# EAGLE design 8085_try2 (EAGLE 9.2.0)
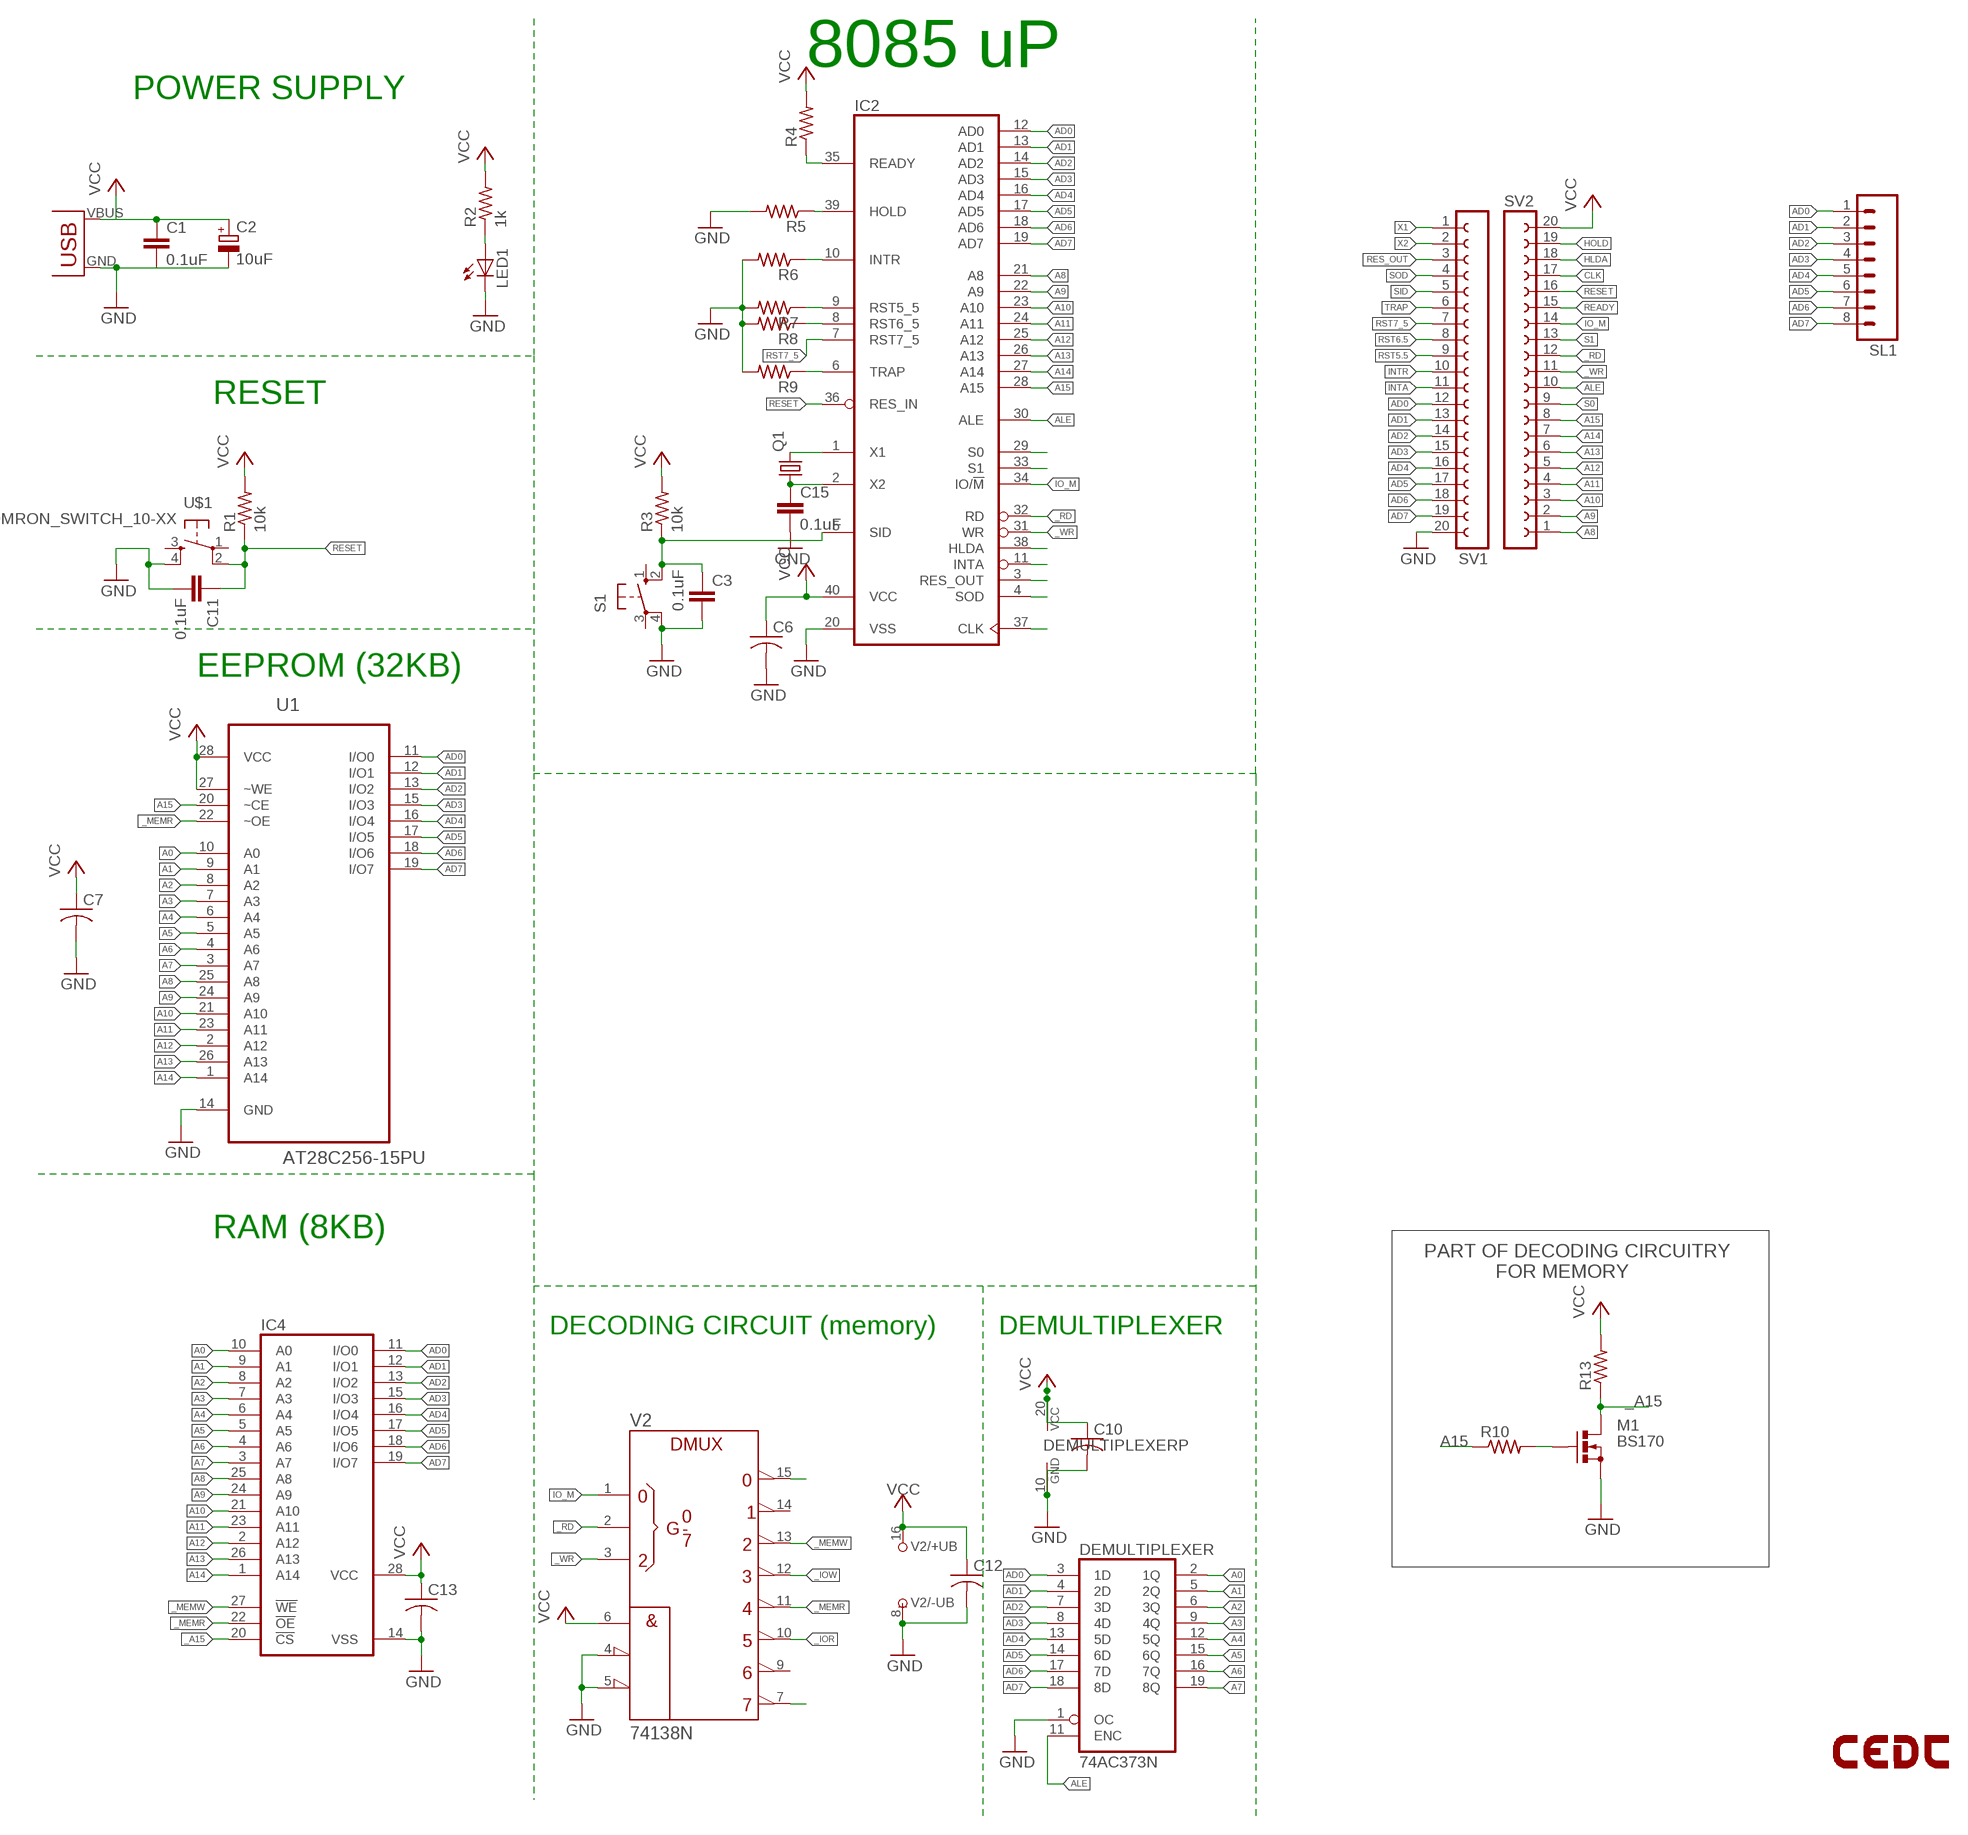
[diagram p0: schematic, sheet 1]

## Parts
C1  0.1uF  C2,5-3  [C2.5-3]
C2  10uF  CPOL-EUE2.5-6  [E2,5-6]
C3  0.1uF  C2,5-3  [C2.5-3]
C6  CAP0805  [C0805]
C7  CAP0805  [C0805]
C10  CAP0805  [C0805]
C11  0.1uF  C2,5-3  [C2.5-3]
C12  CAP0805  [C0805]
C13  CAP0805  [C0805]
C15  0.1uF  C2,5-3  [C2.5-3]
DEMULTIPLEXER  74AC373N  [DIL20]
IC2  8085  [DIL40]
IC4  62256P  [DIL28-6]
LED1  LED3MM  [LED3MM]
LOGO1  LOGO-CEDTBOT-18MM  [LOGO-CEDT-BOT-18MM]
M1  BS170  [SOT54E]
Q1  CRYSTALHC49US  [HC49US]
R1  10k  RESISTOR0207/7  [0207/7]
R2  1k  RESISTOR0207/7  [0207/7]
R3  10k  RESISTOR0207/7  [0207/7]
R4  RESISTOR0805  [R0805]
R5  RESISTOR0805  [R0805]
R6  RESISTOR0805  [R0805]
R7  RESISTOR0805  [R0805]
R8  RESISTOR0805  [R0805]
R9  RESISTOR0805  [R0805]
R10  R-US_0204/5  [0204/5]
R13  R-US_0204/5  [0204/5]
S1  40-XX  [B3F-40XX]
SL1  M08  [08P]
SV1  FE20-1  [FE20]
SV2  FE20-1  [FE20]
U1  AT28C256-15PU  [DIP254P1524X482-28]
U$1  OMRON_SWITCH_10-XX  [B3F-10XX]
U$2  USB(POWER)  [USB(POWER)]
V2  74138N  [DIL16]

## Nets
_A15: IC4.20(!CS) M1.D R13.1
_IOR: V2.10(Y5)
_IOW: V2.12(Y3)
_MEMR: IC4.22(!OE) U1.22(~OE) V2.11(Y4)
_MEMW: IC4.27(!WE) V2.13(Y2)
_RD: IC2.32(RD) SV2.12 V2.2(B)
_WR: IC2.31(WR) SV2.11 V2.3(C)
A0: DEMULTIPLEXER.2(1Q) IC4.10(A0) U1.10(A0)
A1: DEMULTIPLEXER.5(2Q) IC4.9(A1) U1.9(A1)
A2: DEMULTIPLEXER.6(3Q) IC4.8(A2) U1.8(A2)
A3: DEMULTIPLEXER.9(4Q) IC4.7(A3) U1.7(A3)
A4: DEMULTIPLEXER.12(5Q) IC4.6(A4) U1.6(A4)
A5: DEMULTIPLEXER.15(6Q) IC4.5(A5) U1.5(A5)
A6: DEMULTIPLEXER.16(7Q) IC4.4(A6) U1.4(A6)
A7: DEMULTIPLEXER.19(8Q) IC4.3(A7) U1.3(A7)
A8: IC2.21(A8) IC4.25(A8) SV2.1 U1.25(A8)
A9: IC2.22(A9) IC4.24(A9) SV2.2 U1.24(A9)
A10: IC2.23(A10) IC4.21(A10) SV2.3 U1.21(A10)
A11: IC2.24(A11) IC4.23(A11) SV2.4 U1.23(A11)
A12: IC2.25(A12) IC4.2(A12) SV2.5 U1.2(A12)
A13: IC2.26(A13) IC4.26(A13) SV2.6 U1.26(A13)
A14: IC2.27(A14) IC4.1(A14) SV2.7 U1.1(A14)
A15: IC2.28(A15) R10.1 SV2.8 U1.20(~CE)
AD0: DEMULTIPLEXER.3(1D) IC2.12(AD0) IC4.11(I/O0) SL1.1 SV1.12 U1.11(I/O0)
AD1: DEMULTIPLEXER.4(2D) IC2.13(AD1) IC4.12(I/O1) SL1.2 SV1.13 U1.12(I/O1)
AD2: DEMULTIPLEXER.7(3D) IC2.14(AD2) IC4.13(I/O2) SL1.3 SV1.14 U1.13(I/O2)
AD3: DEMULTIPLEXER.8(4D) IC2.15(AD3) IC4.15(I/O3) SL1.4 SV1.15 U1.15(I/O3)
AD4: DEMULTIPLEXER.13(5D) IC2.16(AD4) IC4.16(I/O4) SL1.5 SV1.16 U1.16(I/O4)
AD5: DEMULTIPLEXER.14(6D) IC2.17(AD5) IC4.17(I/O5) SL1.6 SV1.17 U1.17(I/O5)
AD6: DEMULTIPLEXER.17(7D) IC2.18(AD6) IC4.18(I/O6) SL1.7 SV1.18 U1.18(I/O6)
AD7: DEMULTIPLEXER.18(8D) IC2.19(AD7) IC4.19(I/O7) SL1.8 SV1.19 U1.19(I/O7)
ALE: DEMULTIPLEXER.11(ENC) IC2.30(ALE) SV2.10
CLK: IC2.37(CLK) SV2.17
GND: C1.2 C2.- C3.2 C6.2 C7.2 C10.2 C11.2 C12.2 C13.2 C15.2 DEMULTIPLEXER.1(OC) DEMULTIPLEXER.10(GND) IC2.20(VSS) IC4.14(VSS) LED1.K(C) M1.S R5.2 R6.2 R7.2 R8.2 R9.2 S1.4(P1) SV1.20 U1.14(GND) U$1.4(S1) U$2.GND V2.4(!G2A) V2.5(!G2B) V2.8(-UB)
HLDA: IC2.38(HLDA) SV2.18
HOLD: IC2.39(HOLD) R5.1 SV2.19
INTA: IC2.11(INTA) SV1.11
INTR: IC2.10(INTR) R6.1 SV1.10
IO_M: IC2.34(IO/!M) SV2.14 V2.1(A)
N$1: M1.G R10.2
N$7: LED1.A R2.1
N$23: V2.15(Y0)
N$30: V2.7(Y7)
READY: IC2.35(READY) R4.1 SV2.15
RES_OUT: IC2.3(RES_OUT) SV1.3
RESET: C11.1 IC2.36(RES_IN) R1.1 SV2.16 U$1.2(P1)
RST5.5: IC2.9(RST5_5) R7.1 SV1.9
RST6.5: IC2.8(RST6_5) R8.1 SV1.8
RST7_5: IC2.7(RST7_5) SV1.7
S0: IC2.29(S0) SV2.9
S1: IC2.33(S1) SV2.13
SID: C3.1 IC2.5(SID) R3.1 S1.2(S1) SV1.5
SOD: IC2.4(SOD) SV1.4
TRAP: IC2.6(TRAP) R9.1 SV1.6
VCC: C1.1 C2.+ C6.1 C7.1 C10.1 C12.1 C13.1 DEMULTIPLEXER.20(VCC) IC2.40(VCC) IC4.28(VCC) R1.2 R2.2 R3.2 R4.2 R13.2 SV2.20 U1.27(~WE) U1.28(VCC) U$2.VBUS(VCC) V2.6(G1) V2.16(+UB)
X1: IC2.1(X1) Q1.2 SV1.1
X2: C15.1 IC2.2(X2) Q1.1 SV1.2
Unconnected: S1.1(S) S1.3(P) U$1.1(P) U$1.3(S) V2.9(Y6) V2.14(Y1)

## Notes on the sheet
- 8085 uP
- POWER SUPPLY
- RESET
- EEPROM (32KB)
- RAM (8KB)
- PART OF DECODING CIRCUITRY 
               FOR MEMORY
- DECODING CIRCUIT (memory) | DEMULTIPLEXER

## Library data of the parts
C1 C3 C11 C15 = capacitor-wima:C: CAPACITOR naming: grid - package width
C2 = rcl:CPOL-EU: POLARIZED CAPACITOR, European symbol; SPICEPREFIX: C
C6 C7 C10 C12 C13 = CEDT_JANUARY_2015_v7:CAP
DEMULTIPLEXER = 74xx-eu:74*373: Octal D type transparent LATCH, edge triggered
IC2 = micro-intel:8085: MICROCOMPUTER/PERIPHERAL DEVICE; OC_FARNELL: unknown; OC_NEWARK: unknown
IC4 = memory-hitachi:62256P: MEMORY; OC_FARNELL: unknown; OC_NEWARK: unknown
LED1 = CEDT_JANUARY_2015_v7:LED
LOGO1 = CEDT_JANUARY_2015_v7:LOGO-CEDT
M1 = transistor-small-signal:BS170: N-CHANNEL MOS FET
Q1 = CEDT_JANUARY_2015_v7:CRYSTAL: Crystals Various standard crystals. Proven footprints. Spark Fun Electronics SKU : COM-00534
R1-R9 = CEDT_JANUARY_2015_v7:RESISTOR
R10 R13 = resistor:R-US_: RESISTOR, American symbol
S1 = switch-omron:40-XX: OMRON SWITCH; MF: OMRON COMPONENTS USA; MPN: B3F-4000; OC_FARNELL: 176434; OC_NEWARK: 36K3105
SL1 = con-amp-quick:M08: AMP QUICK CONNECTOR; OC_FARNELL: unknown; OC_NEWARK: unknown
SV1 SV2 = con-lsta:FE20-1: FEMALE HEADER; OC_FARNELL: unknown; OC_NEWARK: unknown
U1 = AT28C256-15PU:AT28C256-15PU: Paged Parallel EEPROM; AVAILABILITY: Unavailable; DESCRIPTION: AT28C256 Series 256 Kb _32 K x 8_ 5.5 V Paged Parallel EEPROM - DIP-28; MF: Microchip; MP: AT28C256-15PU; PACKAGE: DIP-28 Microchip; PRICE: None
U$1 = CEDT_JANUARY_2015_v7:OMRON_SWITCH
U$2 = CEDT_JANUARY_2015_v7:USB(POWER)
V2 = 74ttl-din:74*138: 3-line to 8-line DECODER/DEMULTIPLEXER

## Board
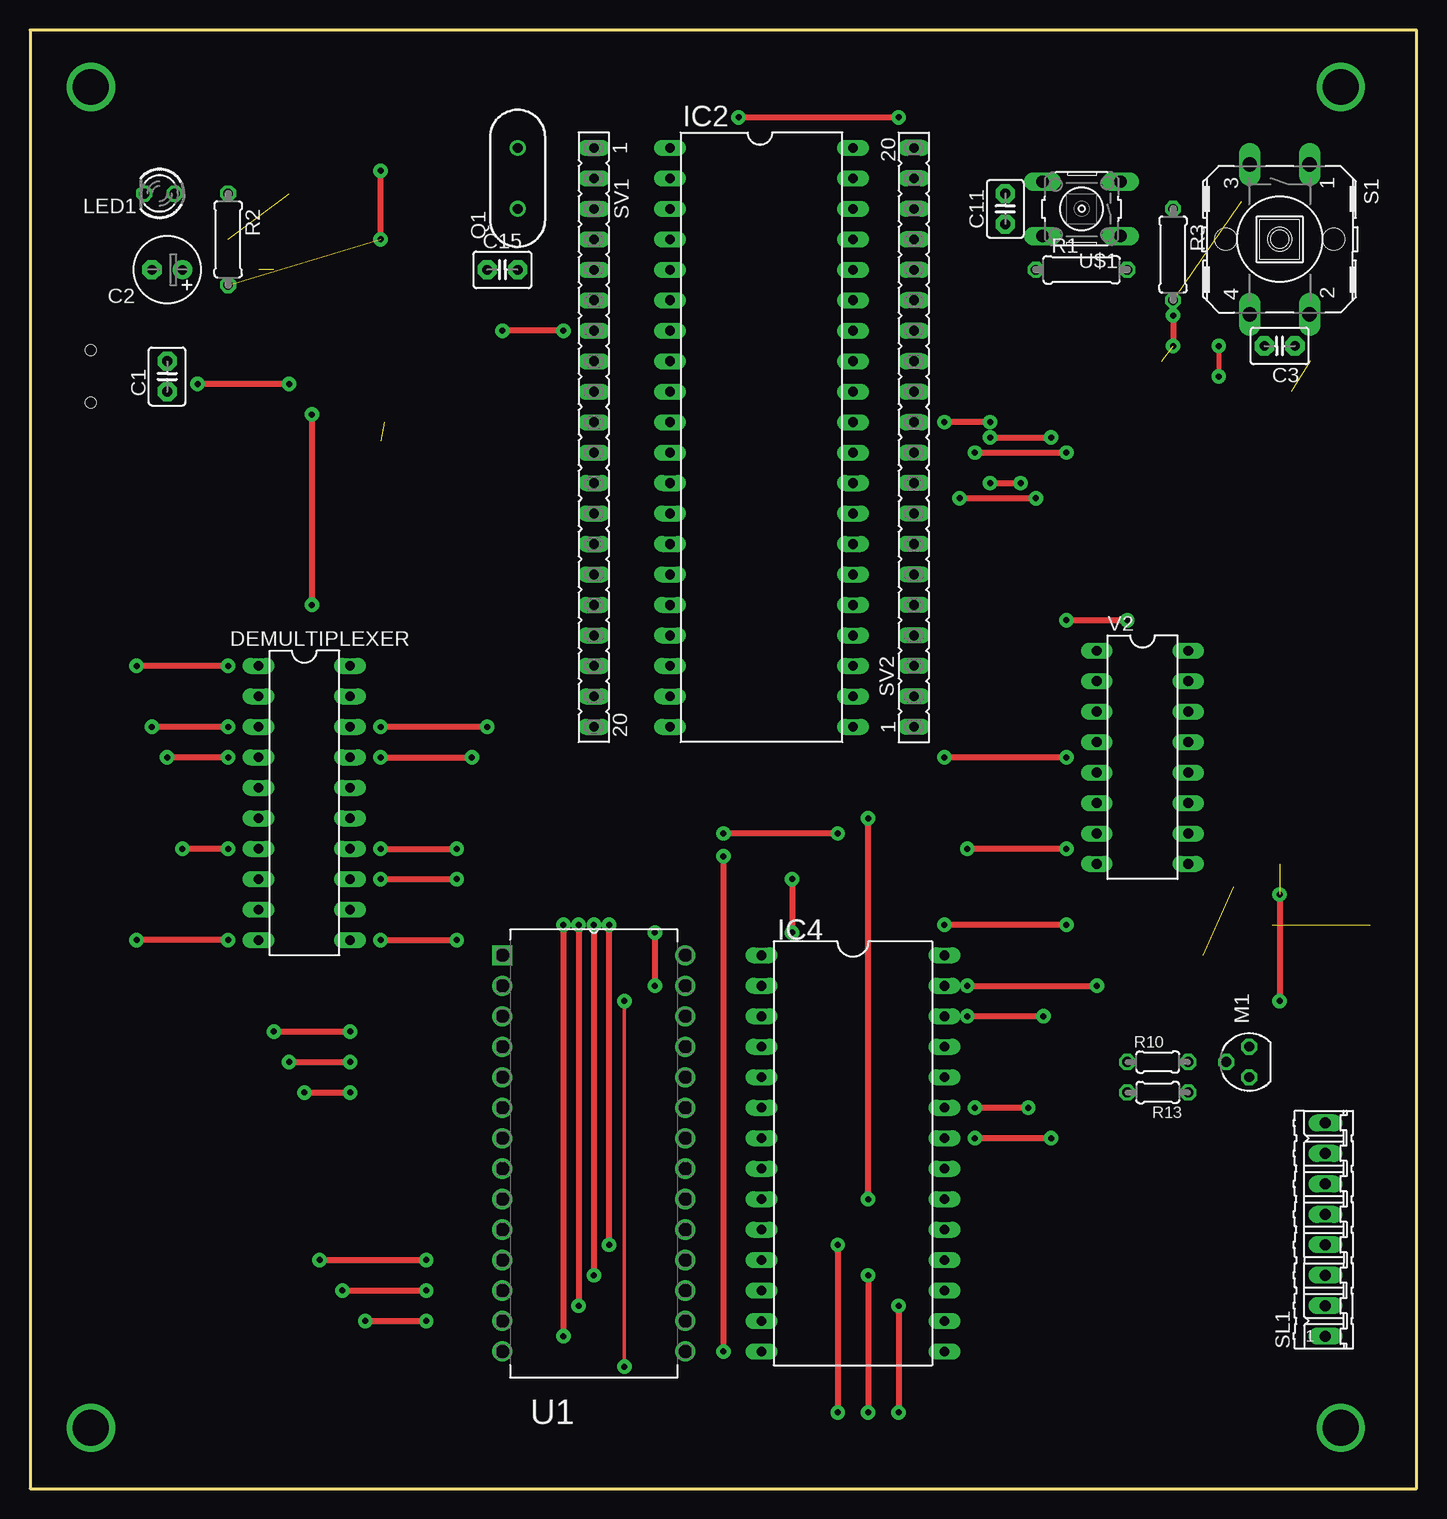
[diagram p1: board, top side]
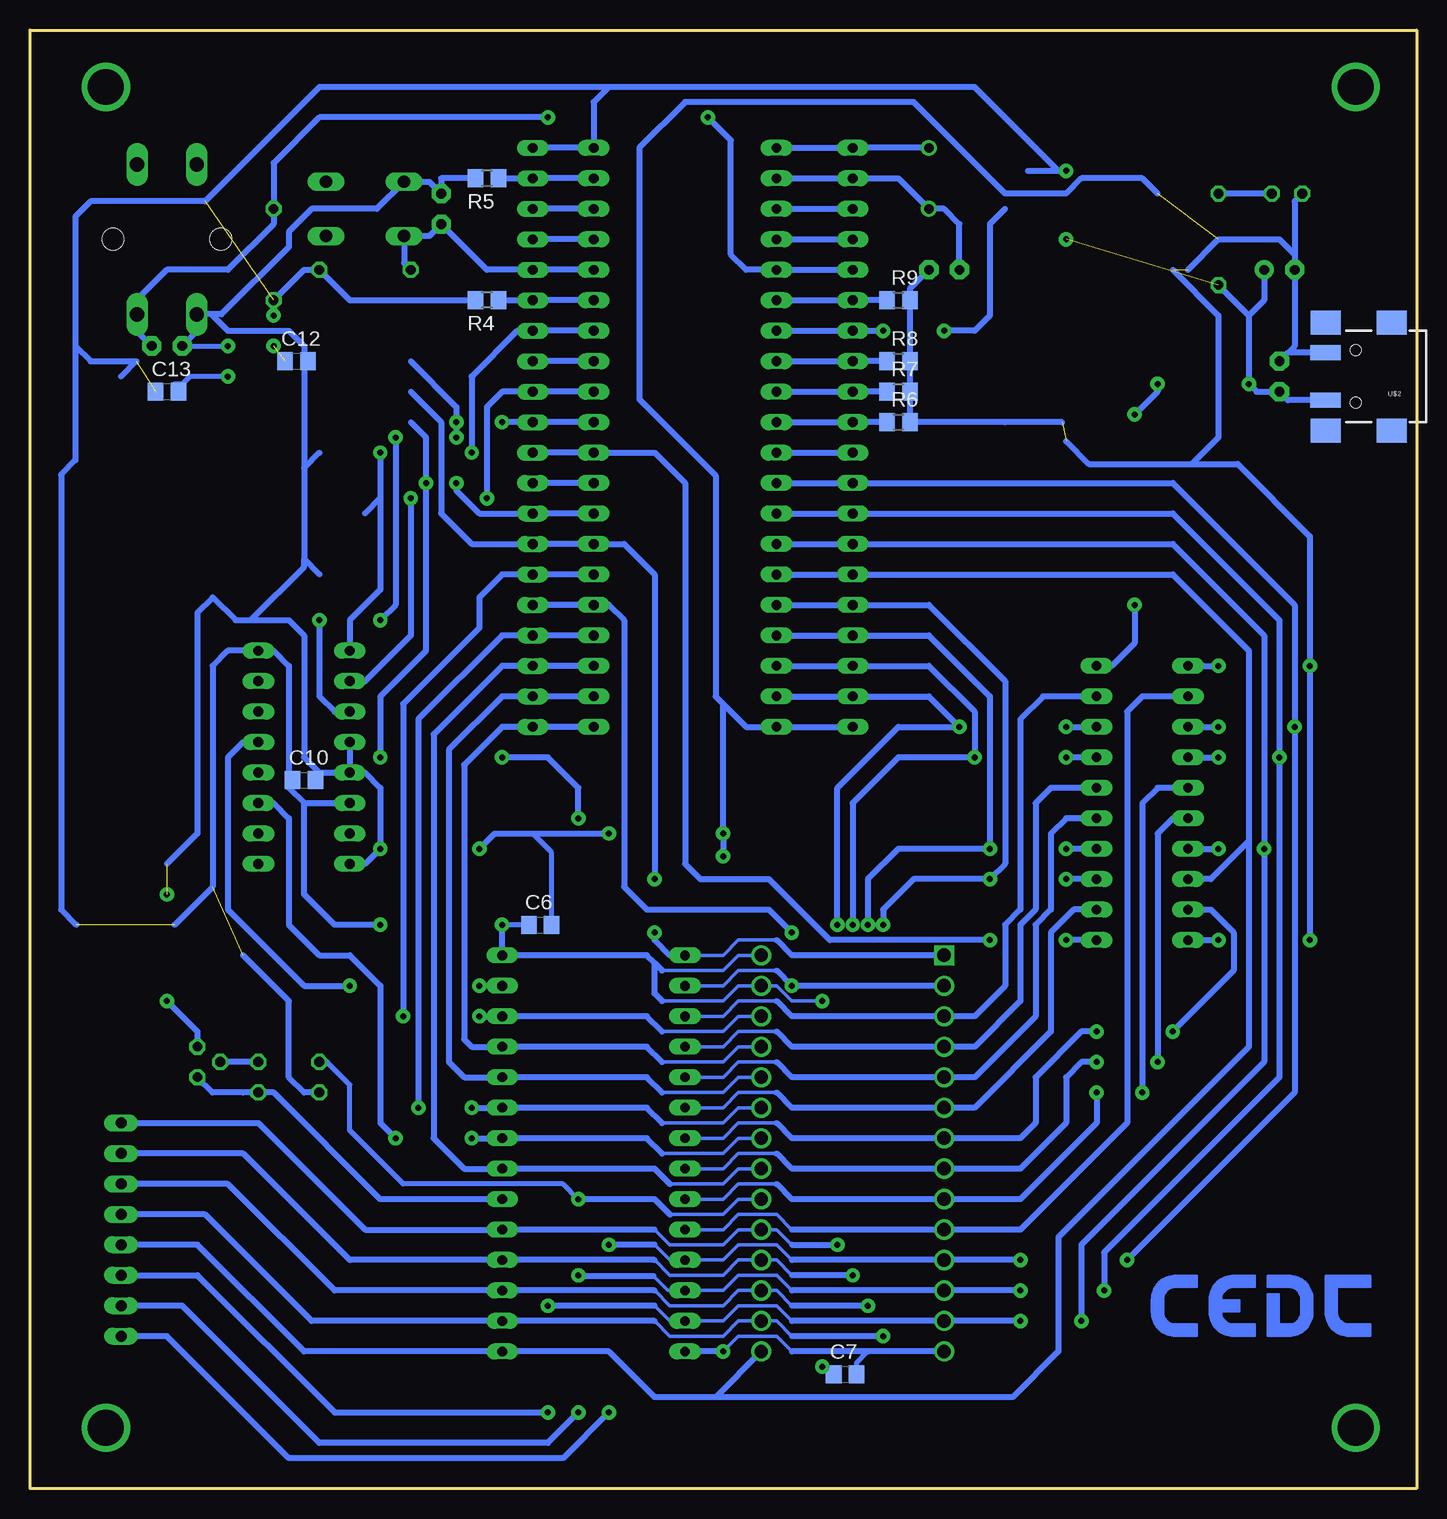
[diagram p2: board, bottom side, seen from below]

Size 115.55 x 121.59 mm. Coordinates in mm from the lower left corner, seen from the top.
Outline: 0,0 115.55,0 115.55,121.59 0,121.59 0,0
Copper layers (1*16): Top 0.035mm / dielectric 1.5mm / Bottom 0.035mm
Design rules "default": minimum track width 6mil, minimum drill 0.35mm, track to track 6mil, track to pad 6mil, pad to pad 6mil, via to via 6mil, smd to smd 6mil, copper to edge 40mil, drill to drill 6mil, minimum pad ring 10mil, minimum via ring 8mil, stop-mask expansion 4mil, vias tented up to drill 0mil, thermal gap 10mil

### Footprints (pad centres in the part's own frame; a part is rotated, then mirrored left to right if it is on the bottom)
C2.5-3 = drill 0.813 pad 1.6 octagon: 1 -1.27,0; 2 1.27,0
E2,5-6 = drill 0.813 pad 1.6: + -1.27,0 | drill 0.813 pad 1.6 octagon: - 1.27,0
C0805 = smd 1.3 x 1.5: 1 -0.95,0; 2 0.95,0
DIL20 = drill 0.813 long: 1 -11.43,-3.81; 2 -8.89,-3.81; 3 -6.35,-3.81; 4 -3.81,-3.81; 5 -1.27,-3.81; 6 1.27,-3.81; 7 3.81,-3.81; 8 6.35,-3.81; 9 8.89,-3.81; 10 11.43,-3.81; 11 11.43,3.81; 12 8.89,3.81; 13 6.35,3.81; 14 3.81,3.81; 15 1.27,3.81; 16 -1.27,3.81; 17 -3.81,3.81; 18 -6.35,3.81; 19 -8.89,3.81; 20 -11.43,3.81
DIL40 = drill 0.813 long: 1 -24.13,-7.62; 2 -21.59,-7.62; 3 -19.05,-7.62; 4 -16.51,-7.62; 5 -13.97,-7.62; 6 -11.43,-7.62; 7 -8.89,-7.62; 8 -6.35,-7.62; 9 -3.81,-7.62; 10 -1.27,-7.62; 11 1.27,-7.62; 12 3.81,-7.62; 13 6.35,-7.62; 14 8.89,-7.62; 15 11.43,-7.62; 16 13.97,-7.62; 17 16.51,-7.62; 18 19.05,-7.62; 19 21.59,-7.62; 20 24.13,-7.62; 21 24.13,7.62; 22 21.59,7.62; 23 19.05,7.62; 24 16.51,7.62; 25 13.97,7.62; 26 11.43,7.62; 27 8.89,7.62; 28 6.35,7.62; 29 3.81,7.62; 30 1.27,7.62; 31 -1.27,7.62; 32 -3.81,7.62; 33 -6.35,7.62; 34 -8.89,7.62; 35 -11.43,7.62; 36 -13.97,7.62; 37 -16.51,7.62; 38 -19.05,7.62; 39 -21.59,7.62; 40 -24.13,7.62
DIL28-6 = drill 0.813 long: 1 -16.51,-7.62; 2 -13.97,-7.62; 3 -11.43,-7.62; 4 -8.89,-7.62; 5 -6.35,-7.62; 6 -3.81,-7.62; 7 -1.27,-7.62; 8 1.27,-7.62; 9 3.81,-7.62; 10 6.35,-7.62; 11 8.89,-7.62; 12 11.43,-7.62; 13 13.97,-7.62; 14 16.51,-7.62; 15 16.51,7.62; 16 13.97,7.62; 17 11.43,7.62; 18 8.89,7.62; 19 6.35,7.62; 20 3.81,7.62; 21 1.27,7.62; 22 -1.27,7.62; 23 -3.81,7.62; 24 -6.35,7.62; 25 -8.89,7.62; 26 -11.43,7.62; 27 -13.97,7.62; 28 -16.51,7.62
LED3MM = drill 0.813 octagon: A -1.27,0; K 1.27,0
SOT54E = drill 0.813 octagon: D -1.27,0; G 0,1.905; S 1.27,0
HC49US = drill 0.813: 1 -2.54,0; 2 2.54,0
0207/7 = drill 0.813 octagon: 1 -3.81,0; 2 3.81,0
R0805 = smd 1.3 x 1.5: 1 -0.95,0; 2 0.95,0
0204/5 = drill 0.813 octagon: 1 -2.54,0; 2 2.54,0
B3F-40XX = drill 1.194 long: 1 -6.248,2.489; 2 6.248,2.489; 3 -6.248,-2.489; 4 6.248,-2.489 | hole 1.803: 0,-4.496; 0,4.496
08P = drill 0.914 long: 1 -8.89,0; 2 -6.35,0; 3 -3.81,0; 4 -1.27,0; 5 1.27,0; 6 3.81,0; 7 6.35,0; 8 8.89,0
FE20 = drill 0.813 long: 1 -24.13,0; 2 -21.59,0; 3 -19.05,0; 4 -16.51,0; 5 -13.97,0; 6 -11.43,0; 7 -8.89,0; 8 -6.35,0; 9 -3.81,0; 10 -1.27,0; 11 1.27,0; 12 3.81,0; 13 6.35,0; 14 8.89,0; 15 11.43,0; 16 13.97,0; 17 16.51,0; 18 19.05,0; 19 21.59,0; 20 24.13,0
DIP254P1524X482-28 = drill 1.118 square: 1 -15.24,33.02 | drill 1.118: 2 -15.24,30.48; 3 -15.24,27.94; 4 -15.24,25.4; 5 -15.24,22.86; 6 -15.24,20.32; 7 -15.24,17.78; 8 -15.24,15.24; 9 -15.24,12.7; 10 -15.24,10.16; 11 -15.24,7.62; 12 -15.24,5.08; 13 -15.24,2.54; 14 -15.24,0; 15 0,0; 16 0,2.54; 17 0,5.08; 18 0,7.62; 19 0,10.16; 20 0,12.7; 21 0,15.24; 22 0,17.78; 23 0,20.32; 24 0,22.86; 25 0,25.4; 26 0,27.94; 27 0,30.48; 28 0,33.02
B3F-10XX = drill 1.016 long: 1 -3.251,2.261; 2 3.251,2.261; 3 -3.251,-2.261; 4 3.251,-2.261
USB(POWER) = smd 2.54 x 1.27: GND 2.5,-1.981; VBUS 2.5,1.981 | smd 2.5 x 2: GND@1 -3,-4.5; GND@2 -3,4.5; GND@3 2.5,4.5; GND@4 2.5,-4.5 | hole 0.9: 0,2.2; 0,-2.2
DIL16 = drill 0.813 long: 1 -8.89,-3.81; 2 -6.35,-3.81; 3 -3.81,-3.81; 4 -1.27,-3.81; 5 1.27,-3.81; 6 3.81,-3.81; 7 6.35,-3.81; 8 8.89,-3.81; 9 8.89,3.81; 10 6.35,3.81; 11 3.81,3.81; 12 1.27,3.81; 13 -1.27,3.81; 14 -3.81,3.81; 15 -6.35,3.81; 16 -8.89,3.81

### Placement (x,y rotation side)
C1  11.43,92.71 90 top
C2  11.43,101.6 180 top
C3  104.14,95.25 180 top
C6  73.03,46.99 0 bottom
C7  47.62,9.53 0 bottom
C10  92.71,59.05 0 bottom
C11  81.28,106.68 90 top
C12  93.34,93.98 0 bottom
C13  104.14,91.44 0 bottom
C15  39.37,101.6 0 top
DEMULTIPLEXER  22.86,57.15 270 top
IC2  60.96,87.63 270 top
IC4  68.58,27.94 270 top
LED1  10.79,107.95 180 top
LOGO1  3.81,12.7 0 top
M1  101.6,35.56 90 top
Q1  40.64,109.22 90 top
R1  87.63,101.6 0 top
R2  16.51,104.14 270 top
R3  95.25,102.87 270 top
R4  77.47,99.06 180 bottom
R5  77.47,109.22 180 bottom
R6  43.18,88.9 0 bottom
R7  43.18,91.44 0 bottom
R8  43.18,93.98 0 bottom
R9  43.18,99.06 0 bottom
R10  93.98,35.56 0 top
R13  93.98,33.02 180 top
S1  104.14,104.14 270 top
SL1  107.95,21.59 90 top
SV1  46.99,87.63 270 top
SV2  73.66,87.63 90 top
U1  54.61,11.43 0 top
U$1  87.63,106.68 180 top
U$2  5.08,92.71 180 bottom
V2  92.71,60.96 270 top

### Tracks (layer width: path | path; a pad name or v marks a point on that pad's centre or on a via)
_A15
  Bottom 0.508: M1.D 100.33,33.02 97.79,33.02 R13.1 95.25,33.02 86.36,24.13 IC4.20
_MEMR  (via drill 0.5 pad 1.2)
  Top 0.508: v85.09,29.21 v78.74,29.21
  Bottom 0.305: U1.22 56.52,29.21 57.78,27.94 62.87,27.94
  Bottom 0.508: v85.09,29.21 86.36,30.48 86.36,41.91 88.9,44.45 91.44,44.45 93.98,46.99 93.98,55.88 95.25,57.15 V2.11 | v78.74,29.21 IC4.22 64.14,29.21 62.87,27.94
_MEMW  (via drill 0.5 pad 1.2)
  Top 0.508: v78.11,41.91 v88.9,41.91
  Bottom 0.508: IC4.27 v78.11,41.91 | v88.9,41.91 92.71,41.91 99.06,48.26 99.06,60.96 97.79,62.23 V2.13
_RD  (via drill 0.5 pad 1.2)
  Top 0.508: v77.47,82.55 v83.82,82.55
  Bottom 0.508: IC2.32 SV2.12 76.2,91.44 77.47,90.17 v77.47,82.55 | v83.82,82.55 83.82,71.12 87.63,67.31 V2.2
_WR  (via drill 0.5 pad 1.2)
  Top 0.508: v80.01,88.9 v76.2,88.9 | v80.01,87.63 v85.09,87.63 | v86.36,72.39 v91.44,72.39
  Bottom 0.508: IC2.31 SV2.11 v76.2,88.9 | v85.09,87.63 85.09,73.66 v86.36,72.39 | 83.82,93.98 80.01,90.17 v80.01,88.9 v80.01,87.63 | v91.44,72.39 91.44,66.04 90.17,64.77 V2.3
A0
  Bottom 0.305: 52.07,21.59 53.34,22.86 56.52,22.86 57.78,21.59 IC4.10
  Bottom 0.508: 52.07,21.59 U1.10 33.02,21.59 24.13,30.48 24.13,64.77 22.86,66.04 DEMULTIPLEXER.2
A1  (via drill 0.5 pad 1.2)
  Top 0.508: v22.86,33.02 v26.67,33.02
  Bottom 0.305: 53.34,25.4 56.52,25.4 57.78,24.13 IC4.9
  Bottom 0.508: 53.34,25.4 52.07,24.13 U1.9 33.02,24.13 26.67,30.48 v26.67,33.02 | DEMULTIPLEXER.5 21.59,58.42 22.86,57.15 v22.86,33.02
A2  (via drill 0.5 pad 1.2)
  Top 0.508: v21.59,35.56 v26.67,35.56
  Bottom 0.305: 53.34,27.94 56.52,27.94 57.78,26.67 IC4.8
  Bottom 0.508: 53.34,27.94 52.07,26.67 U1.8 33.02,26.67 29.21,30.48 29.21,34.29 27.94,35.56 v26.67,35.56 | DEMULTIPLEXER.6 20.32,55.88 21.59,54.61 v21.59,35.56
A3  (via drill 0.5 pad 1.2)
  Top 0.508: v20.32,38.1 v26.67,38.1
  Bottom 0.305: 53.34,30.48 56.52,30.48 57.78,29.21 IC4.7
  Bottom 0.508: 53.34,30.48 52.07,29.21 U1.7 33.02,29.21 31.75,30.48 31.75,34.29 27.94,38.1 v26.67,38.1 | DEMULTIPLEXER.9 17.14,48.26 15.24,46.35 15.24,43.18 v20.32,38.1
A4
  Bottom 0.305: 53.34,33.02 56.52,33.02 57.78,31.75 IC4.6
  Bottom 0.508: 53.34,33.02 52.07,31.75 U1.6 36.83,31.75 30.48,38.1 30.48,46.35 28.57,48.26 DEMULTIPLEXER.12
A5
  Bottom 0.305: 53.34,35.56 56.52,35.56 57.78,34.29 IC4.5
  Bottom 0.508: 53.34,35.56 52.07,34.29 U1.5 36.83,34.29 31.75,39.37 31.75,46.99 30.48,48.26 30.48,54.61 29.21,55.88 DEMULTIPLEXER.15
A6
  Bottom 0.305: 53.34,38.1 56.52,38.1 57.78,36.83 IC4.4
  Bottom 0.508: 53.34,38.1 52.07,36.83 U1.4 36.83,36.83 33.02,40.64 33.02,46.99 31.75,48.26 31.75,57.15 30.48,58.42 DEMULTIPLEXER.16
A7
  Bottom 0.305: 53.34,40.64 56.52,40.64 57.78,39.37 IC4.3
  Bottom 0.508: 53.34,40.64 52.07,39.37 U1.3 36.83,39.37 34.29,41.91 34.29,46.99 33.02,48.26 33.02,64.14 31.11,66.04 DEMULTIPLEXER.19
A8
  Bottom 0.305: U1.25 56.52,36.83 57.78,35.56 62.87,35.56
  Bottom 0.508: IC2.21 SV2.1 76.2,63.5 79.38,60.33 79.38,37.47 78.74,36.83 IC4.25 64.14,36.83 62.87,35.56
A9
  Bottom 0.305: U1.24 56.52,34.29 57.78,33.02 62.87,33.02
  Bottom 0.508: IC2.22 SV2.2 76.2,66.04 80.64,61.59 80.64,35.56 79.38,34.29 IC4.24 64.14,34.29 62.87,33.02
A10
  Bottom 0.305: U1.21 56.52,26.67 57.78,25.4 62.23,25.4
  Bottom 0.508: IC2.23 SV2.3 76.2,68.58 81.92,62.87 81.92,29.21 79.38,26.67 IC4.21 63.5,26.67 62.23,25.4
A11  (via drill 0.5 pad 1.2)
  Top 0.508: v83.19,31.75 v78.74,31.75
  Bottom 0.305: U1.23 56.52,31.75 57.78,30.48 62.87,30.48
  Bottom 0.508: IC2.24 SV2.4 76.2,71.12 83.19,64.14 v83.19,31.75 | 62.87,30.48 64.14,31.75 IC4.23 v78.74,31.75
A12  (via drill 0.5 pad 1.2)
  Top 0.508: v52.07,46.35 v52.07,41.91
  Bottom 0.305: 53.34,43.18 56.52,43.18 57.78,41.91 IC4.2
  Bottom 0.508: SV2.5 IC2.25 67.31,73.66 66.04,72.39 66.04,50.16 64.14,48.26 53.98,48.26 v52.07,46.35 | U1.2 v52.07,41.91 53.34,43.18
A13  (via drill 0.5 pad 1.2)
  Top 0.508: v84.45,39.37 v78.11,39.37
  Bottom 0.305: U1.26 56.52,39.37 57.78,38.1 62.87,38.1
  Bottom 0.508: IC2.26 SV2.6 76.2,76.2 78.11,74.3 78.11,71.75 84.45,65.41 v84.45,39.37 | 62.87,38.1 64.14,39.37 IC4.26 v78.11,39.37
A14  (via drill 0.5 pad 1.2)
  Top 0.508: v63.5,50.8 v63.5,46.35
  Bottom 0.305: IC4.1 57.78,44.45 56.52,45.72 53.34,45.72
  Bottom 0.508: 83.82,91.44 81.28,88.9 81.28,81.28 78.74,78.74 SV2.7 IC2.27 66.04,78.74 63.5,76.2 v63.5,50.8 | U1.1 52.07,44.45 53.34,45.72 | v63.5,46.35 63.5,45.72 62.23,44.45 IC4.1
A15  (via drill 0.5 pad 1.2)
  Top 0.508: v80.01,83.82 v82.55,83.82 | v69.85,24.13 v69.85,55.88 | v86.36,60.96 v76.2,60.96
  Bottom 0.305: U1.20 56.52,24.13 57.78,22.86 62.23,22.86
  Bottom 0.406: v69.85,24.13 71.12,25.4 84.45,25.4 88.9,29.84 88.9,33.66 90.81,35.56
  Bottom 0.508: IC2.28 SV2.8 78.11,81.28 80.01,83.19 v80.01,83.82 | 83.82,88.9 82.55,87.63 v82.55,83.82 82.55,69.85 86.36,66.04 v86.36,60.96 | 62.23,22.86 63.5,24.13 v69.85,24.13 | v76.2,60.96 72.39,60.96 69.85,58.42 v69.85,55.88 | 90.81,35.56 R10.1
AD0  (via drill 0.5 pad 1.2)
  Top 0.508: v16.51,63.5 v10.16,63.5 | v24.13,19.05 v33.02,19.05 | v67.31,20.32 v67.31,6.35
  Bottom 0.305: 52.07,19.05 53.34,20.32 56.52,20.32 57.78,19.05 IC4.11 62.23,19.05 63.5,20.32
  Bottom 0.508: IC2.12 SV1.12 20.32,83.82 10.16,73.66 v10.16,63.5 10.16,33.02 v24.13,19.05 | 52.07,19.05 U1.11 v33.02,19.05 | DEMULTIPLEXER.3 v16.51,63.5 | 63.5,20.32 v67.31,20.32 | v67.31,6.35 71.12,2.54 93.98,2.54 104.14,12.7 SL1.1
AD1  (via drill 0.5 pad 1.2)
  Top 0.508: v16.51,60.96 v11.43,60.96 | v26.04,16.51 v33.02,16.51 | v69.85,17.78 v69.85,6.35
  Bottom 0.305: 52.07,16.51 53.34,17.78 56.52,17.78 57.78,16.51 IC4.12 62.38,16.51 63.58,17.7
  Bottom 0.508: IC2.13 SV1.13 20.32,81.28 11.43,72.39 v11.43,60.96 11.43,34.29 26.04,19.68 v26.04,16.51 | 52.07,16.51 U1.12 v33.02,16.51 | DEMULTIPLEXER.4 v16.51,60.96 | v69.85,17.78 69.77,17.7 63.58,17.7 | v69.85,6.35 72.39,3.81 91.44,3.81 102.87,15.24 SL1.2
AD2  (via drill 0.5 pad 1.2)
  Top 0.508: v16.51,53.34 v12.7,53.34 | v27.94,13.97 v33.02,13.97 | v72.39,15.24 v72.39,6.35
  Bottom 0.305: 52.07,13.97 53.34,15.24 56.52,15.24 57.78,13.97 IC4.13 62.23,13.97 63.5,15.24
  Bottom 0.508: IC2.14 SV1.14 20.32,78.74 12.7,71.12 v12.7,53.34 12.7,35.56 27.94,20.32 v27.94,13.97 | 52.07,13.97 U1.13 v33.02,13.97 | DEMULTIPLEXER.7 v16.51,53.34 | 63.5,15.24 v72.39,15.24 | SL1.3 101.6,17.78 90.17,6.35 v72.39,6.35
AD3
  Bottom 0.508: IC2.15 SV1.15 20.32,76.2 13.97,69.85 13.97,53.98 | U1.15 58.42,7.62 | 58.42,7.62 63.5,7.62 67.31,11.43 IC4.15 92.71,11.43 101.6,20.32 SL1.4 | 13.97,53.98 17.14,50.8 DEMULTIPLEXER.8 | 13.97,53.98 13.97,36.83 29.84,20.95 29.84,11.43 33.66,7.62 58.42,7.62
AD4  (via drill 0.5 pad 1.2)
  Top 0.508: v44.45,46.99 v44.45,12.7 | v29.21,50.8 v35.56,50.8
  Bottom 0.305: 63.5,13.97 62.23,12.7 57.78,12.7 56.52,13.97 U1.16 53.34,13.97 52.07,12.7
  Bottom 0.508: IC2.16 SV1.16 40.64,73.66 34.29,67.31 34.29,52.07 v35.56,50.8 41.91,50.8 44.45,48.26 v44.45,46.99 | 63.5,13.97 IC4.16 92.08,13.97 100.97,22.86 SL1.5 | v44.45,12.7 52.07,12.7 | DEMULTIPLEXER.13 v29.21,50.8
AD5  (via drill 0.5 pad 1.2)
  Top 0.508: v29.21,53.34 v35.56,53.34 | v45.72,46.99 v45.72,15.24
  Bottom 0.305: 63.5,16.51 62.23,15.24 57.78,15.24 56.52,16.51 U1.17 53.34,16.51 52.07,15.24
  Bottom 0.508: IC2.17 SV1.17 40.64,71.12 35.56,66.04 v35.56,53.34 43.18,53.34 45.72,50.8 v45.72,46.99 | 63.5,16.51 IC4.17 90.17,16.51 99.06,25.4 SL1.6 | DEMULTIPLEXER.14 v29.21,53.34 | v45.72,15.24 52.07,15.24
AD6  (via drill 0.5 pad 1.2)
  Top 0.508: v29.21,60.96 v36.83,60.96 | v46.99,46.99 v46.99,17.78
  Bottom 0.305: 63.5,19.05 62.23,17.78 57.78,17.78 56.52,19.05 U1.18 53.34,19.05 52.07,17.78
  Bottom 0.508: IC2.18 SV1.18 40.64,68.58 36.83,64.77 v36.83,60.96 43.18,60.96 46.99,57.15 v46.99,46.99 | 63.5,19.05 IC4.18 88.9,19.05 97.79,27.94 SL1.7 | DEMULTIPLEXER.17 v29.21,60.96 | v46.99,17.78 52.07,17.78
AD7  (via drill 0.5 pad 1.2)
  Top 0.508: v38.1,63.5 v29.21,63.5 | v48.26,20.32 v48.26,46.99
  Bottom 0.305: 63.5,21.59 62.23,20.32 57.78,20.32 56.52,21.59 U1.19 53.34,21.59 52.07,20.32
  Bottom 0.508: IC2.19 SV1.19 40.64,66.04 v38.1,63.5 43.18,63.5 48.26,58.42 v48.26,46.99 | 63.5,21.59 IC4.19 87.63,21.59 96.52,30.48 SL1.8 | v29.21,63.5 DEMULTIPLEXER.18 | 52.07,20.32 v48.26,20.32
ALE  (via drill 0.5 pad 1.2)
  Top 0.508: v29.21,45.72 v35.56,45.72
  Bottom 0.508: SV2.10 IC2.30 63.5,86.36 60.96,83.82 60.96,52.07 59.69,50.8 53.98,50.8 48.9,45.72 v35.56,45.72 | DEMULTIPLEXER.11 v29.21,45.72
CLK
  Bottom 0.508: IC2.37 SV2.17
GND  (via drill 0.5 pad 1.2)  (4 unrouted)
  Top 0.406: v99.06,95.25 v99.06,92.71
  Top 0.508: v16.51,68.58 v8.89,68.58 | v16.51,45.72 v8.89,45.72 | v86.36,53.34 v78.11,53.34 | v67.31,54.61 v57.78,54.61 | v57.78,52.7 v57.78,11.43 | v104.14,49.53 v104.14,40.64
  Bottom 0.305: 52.07,11.43 53.34,12.7 56.52,12.7 v57.78,11.43 | C10.2 91.76,59.37 91.44,59.69 | C12.2 92.71,93.98
  Bottom 0.406: C6.2 72.08,53.02 73.66,54.61 | C7.2 46.67,10.47 45.72,11.43 | C3.2 v99.06,95.25 | v99.06,92.71 102.23,92.71 102.87,92.08 103.5,92.08 103.5,91.75 C13.2
  Bottom 0.508: SV1.20 IC2.20 55.88,63.5 57.78,65.41 | C15.2 42.23,100.01 R9.2 R8.2 R7.2 R6.2 34.29,88.9 29.53,88.9 | 20.32,101.6 16.51,97.79 16.51,87.63 18.73,85.41 | 29.21,87.31 27.3,85.41 18.73,85.41 | 18.73,85.41 14.92,85.41 8.89,79.38 v8.89,68.58 v8.89,45.72 | R5.2 81.28,109.22 C11.2 82.27,108.94 U$1.4 86.64,106.68 92.08,106.68 93.98,104.78 93.98,103.5 99.59,97.89 S1.4 | S1.4 100.43,97.89 99.06,96.52 93.98,96.52 92.71,95.25 92.71,93.98 92.71,85.09 | C2.- 10.16,95.25 C1.2 10.72,94.69 U$2.GND | 19.05,101.6 16.51,104.14 11.43,104.14 10.16,102.87 C2.- | 91.44,86.36 92.71,85.09 | 91.44,76.2 92.71,77.47 | 92.71,85.09 92.71,77.47 | 97.16,72.39 98.42,72.39 100.33,74.3 101.6,73.03 101.6,54.61 104.14,52.07 | 97.16,72.39 92.71,76.83 92.71,77.47 | U1.14 45.72,11.43 52.07,11.43 | v57.78,11.43 IC4.14 | LED1.K 10.16,107.31 C2.- | V2.5 87.63,59.69 86.36,58.42 v86.36,53.34 87.63,52.07 V2.8 | 97.16,72.39 93.98,72.39 92.71,71.12 92.71,60.96 91.44,59.69 V2.5 | C3.2 101.65,96.47 S1.4 | 21.59,107.95 22.86,109.22 27.94,109.22 29.21,107.95 34.29,107.95 41.91,115.57 60.96,115.57 64.77,111.76 64.77,90.81 58.42,84.45 58.42,66.04 57.78,65.41 | v57.78,52.7 v57.78,54.61 57.78,65.41 | DEMULTIPLEXER.1 17.78,68.58 v16.51,68.58 | DEMULTIPLEXER.10 v16.51,45.72 | v78.11,53.34 76.83,54.61 73.66,54.61 v67.31,54.61 | V2.4 V2.5 | v104.14,40.64 101.6,38.1 M1.S
HLDA
  Bottom 0.508: IC2.38 SV2.18
HOLD
  Bottom 0.508: IC2.39 SV2.19 R5.1
INTA
  Bottom 0.508: IC2.11 SV1.11
INTR
  Bottom 0.508: IC2.10 SV1.10 R6.1
IO_M  (via drill 0.5 pad 1.2)
  Top 0.508: v78.74,86.36 v86.36,86.36
  Bottom 0.508: IC2.34 SV2.14 74.93,96.52 78.74,92.71 v78.74,86.36 | v86.36,86.36 86.36,82.55 | 86.36,82.55 87.63,81.28 | 86.36,82.55 86.36,74.93 88.9,72.39 V2.1
N$1
  Bottom 0.508: R10.2 M1.G
N$4  (via drill 3 pad 1.2)
  other vias: 109.22,116.84
N$6  (via drill 3 pad 1.2)
  other vias: 109.22,5.08
N$7
  Bottom 0.508: LED1.A R2.1
N$8  (via drill 3 pad 1.2)
  other vias: 5.08,5.08
N$9  (via drill 3 pad 1.2)
  other vias: 5.08,116.84
READY
  Bottom 0.508: IC2.35 SV2.15 R4.1
RES_OUT
  Bottom 0.508: IC2.3 SV1.3
RESET
  Bottom 0.508: IC2.36 SV2.16 77.47,101.6 C11.1 82.27,104.42 U$1.2 84.38,102.16 R1.1
RST5.5
  Bottom 0.508: IC2.9 SV1.9 R7.1
RST6.5
  Bottom 0.508: IC2.8 SV1.8 R8.1
RST7_5  (via drill 0.5 pad 1.2)
  Top 0.508: v44.45,96.52 v39.37,96.52
  Bottom 0.508: IC2.7 SV1.7 v44.45,96.52 | v39.37,96.52 36.83,96.52 35.56,97.79 35.56,105.41 34.29,106.68
S0
  Bottom 0.508: IC2.29 SV2.9
S1
  Bottom 0.508: IC2.33 SV2.13
SID  (via drill 0.5 pad 1.2)
  Top 0.508: v59.05,114.3 v72.39,114.3
  Bottom 0.508: SV1.5 IC2.5 55.88,101.6 57.15,102.87 57.15,112.39 v59.05,114.3 | v72.39,114.3 91.44,114.3 95.25,110.49 R3.1 95.25,105.41 99.06,101.6 104.14,101.6 106.68,99.06 106.63,99.01 S1.2 106.63,96.57 106.68,96.52 C3.1
SOD
  Bottom 0.508: IC2.4 SV1.4
TRAP
  Bottom 0.508: IC2.6 SV1.6 R9.1
VCC  (via drill 0.5 pad 1.2)  (6 unrouted)
  Top 0.305: v49.53,40.64 v49.53,10.16
  Top 0.508: v29.21,104.14 v29.21,109.86 | v95.25,97.79 v95.25,95.25 | v86.36,46.99 v76.2,46.99 | v21.59,92.08 v13.97,92.08 | v23.5,89.53 v23.5,73.66
  Bottom 0.305: U1.28 56.52,44.45 57.78,43.18 62.87,43.18 | 62.87,40.64 57.78,40.64 56.52,41.91 U1.27 53.34,41.91 52.07,40.64 v49.53,40.64 | v49.53,10.16 48.9,9.53 C7.1 48.26,9.53 | C10.1 93.66,58.74 93.98,58.42
  Bottom 0.406: C6.1 v76.2,46.99
  Bottom 0.508: SV2.20 IC2.40 68.58,115.57 67.31,116.84 | 29.84,109.86 36.83,116.84 67.31,116.84 | 32.38,109.86 29.84,109.86 | 29.84,109.86 v29.21,109.86 | R4.2 88.9,99.06 R1.2 92.71,101.6 R3.2 v95.25,97.79 | C2.+ 12.7,99.06 13.97,97.79 | 13.97,97.79 v13.97,92.08 13.34,91.44 C1.1 10.72,90.73 U$2.VBUS | 107.95,92.71 106.68,93.98 110.49,93.98 111.76,95.25 | 67.31,116.84 91.44,116.84 100.97,107.31 110.49,107.31 111.76,106.05 111.76,95.25 | 62.87,43.18 63.5,43.81 | 63.5,43.81 64.14,44.45 IC4.28 v76.2,46.99 | 62.87,40.64 63.5,41.27 63.5,43.81 | R2.2 13.97,97.79 | 92.71,57.15 93.98,58.42 93.98,68.58 95.25,69.85 V2.16 99.06,69.85 100.33,68.58 100.33,50.16 103.5,46.99 | 92.71,57.15 V2.6 | 111.76,95.25 111.76,85.72 112.96,84.53 112.96,48.26 111.69,46.99 | v86.36,46.99 90.17,46.99 92.71,49.53 92.71,57.15 | v21.59,92.08 21.59,91.44 v23.5,89.53 | v23.5,73.66 23.5,70.48 25.4,68.58 DEMULTIPLEXER.20 | R13.2 92.71,33.02 93.98,34.29 93.98,40.64 97.79,44.45
X1
  Bottom 0.508: IC2.1 SV1.1 Q1.2
X2
  Bottom 0.508: IC2.2 SV1.2 43.18,109.22 Q1.1 39.37,106.68 38.1,105.41 C15.1

### Text on the board
Edge: CRYSTAL | PLAY | X1 | RESET | VCC | X2 | HOLD | ON | RESET | HLDA | SOD | CLK | SID | RESET | TRAP | READY | RST7.5 | IO_M | RST6.5 | S1 | RST5.5 | _RD | INTR | _WR | INTA | ALE | AD0 | S0 | AD1 | A15 | AD2 | A14 | AD3 | A13 | AD4 | A12 | DECODER | INVERTER | AD5 | A11 | AD6 | A10 | AD7 | A9 | GND | A8 | E1 | 8085 | E2 | E3 | E4 | GND | VCC | D7 | D6 | D5 | D4 | D3 | D2 | D1 | D0 | EEPROM | RAM